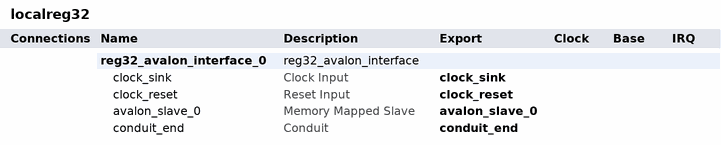
[diagram p0: system contents]
# Platform Designer (Qsys) system localreg32, Cyclone V 5CSEBA6U23I7
# Parameters at their usual value, and those the tool derives, are not listed.
package require qsys
create_system localreg32
set_project_property DEVICE_FAMILY {Cyclone V}
set_project_property DEVICE 5CSEBA6U23I7

add_instance reg32_avalon_interface_0 reg32_avalon_interface 1.0
set_instance_property reg32_avalon_interface_0 AUTO_EXPORT true

# exported interfaces
add_interface avalon_slave_0 avalon slave
set_interface_property avalon_slave_0 EXPORT_OF reg32_avalon_interface_0.avalon_slave_0
add_interface clock_reset reset sink
set_interface_property clock_reset EXPORT_OF reg32_avalon_interface_0.clock_reset
add_interface clock_sink clock sink
set_interface_property clock_sink EXPORT_OF reg32_avalon_interface_0.clock_sink
add_interface conduit_end conduit end
set_interface_property conduit_end EXPORT_OF reg32_avalon_interface_0.conduit_end

set_interconnect_requirement {$system} qsys_mm.clockCrossingAdapter HANDSHAKE
set_interconnect_requirement {$system} qsys_mm.enableEccProtection FALSE
set_interconnect_requirement {$system} qsys_mm.insertDefaultSlave FALSE
set_interconnect_requirement {$system} qsys_mm.maxAdditionalLatency 1

save_system localreg32.qsys
